# EAGLE design ifcBoard (EAGLE 9.6.2)
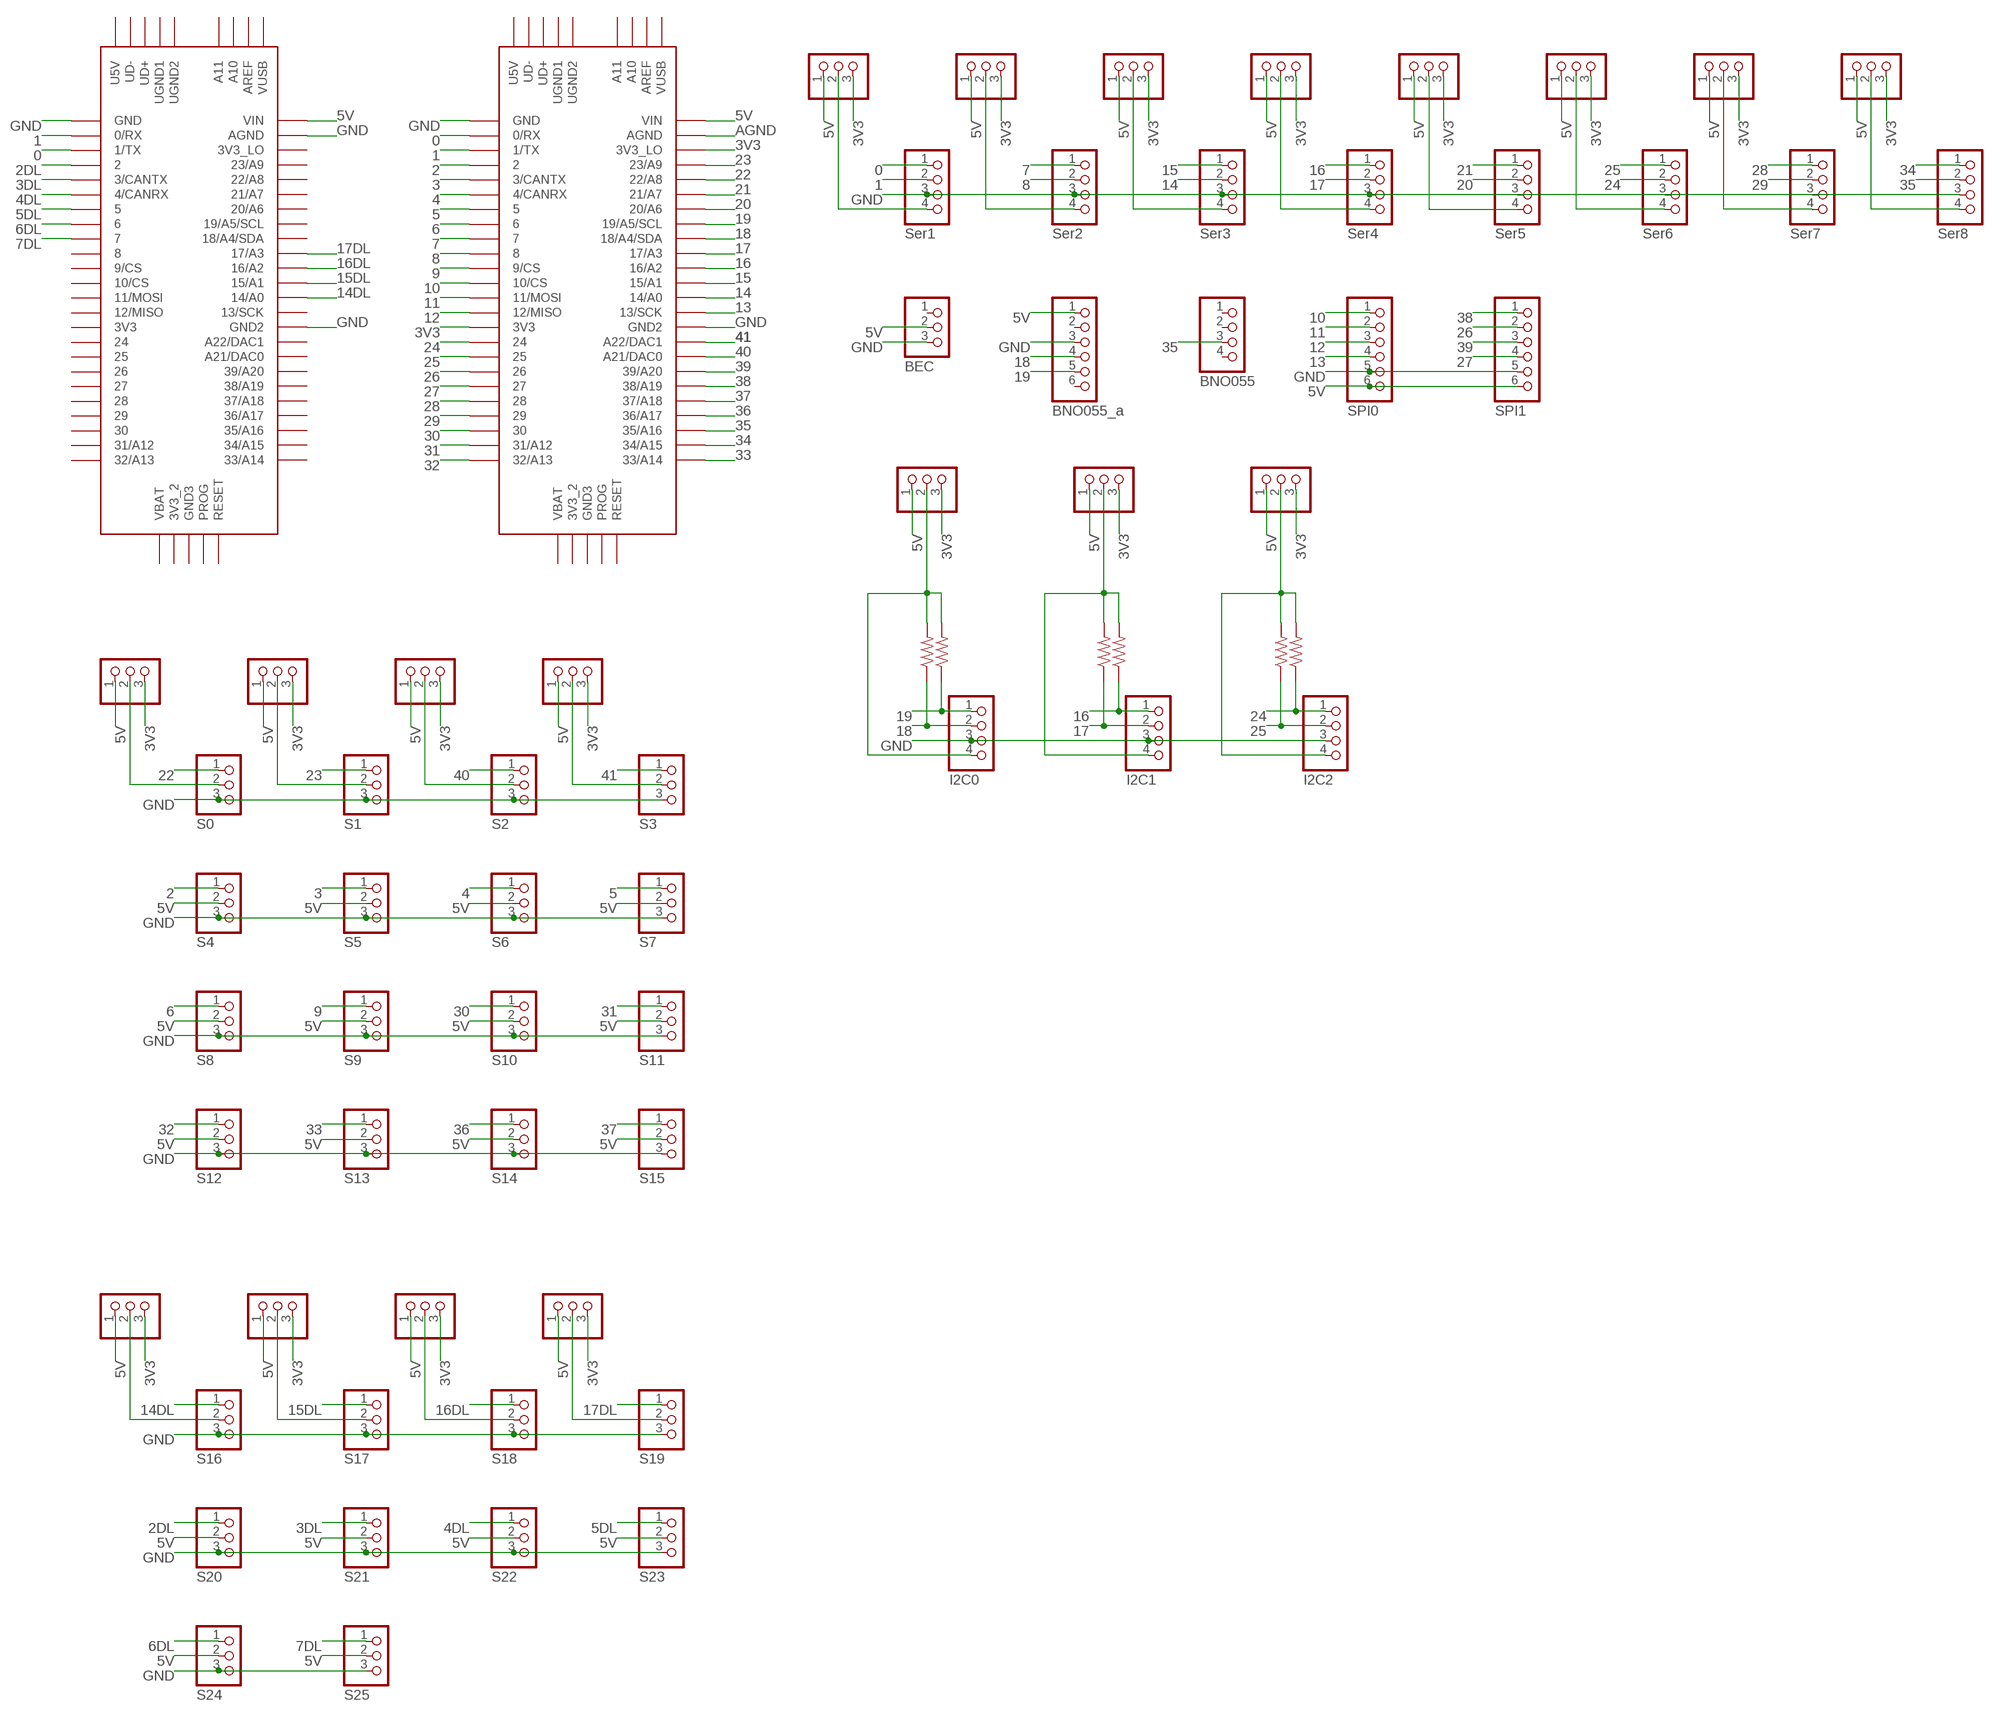
[diagram p0: schematic, sheet 1]

## Parts
JP1  BEC  PINHD-1X3  [1X03]
JP2  S0  PINHD-1X3  [1X03]
JP3  S1  PINHD-1X3  [1X03]
JP4  S2  PINHD-1X3  [1X03]
JP5  S3  PINHD-1X3  [1X03]
JP6  S4  PINHD-1X3  [1X03]
JP7  S5  PINHD-1X3  [1X03]
JP8  S6  PINHD-1X3  [1X03]
JP9  S7  PINHD-1X3  [1X03]
JP10  S8  PINHD-1X3  [1X03]
JP11  S9  PINHD-1X3  [1X03]
JP12  S10  PINHD-1X3  [1X03]
JP13  S11  PINHD-1X3  [1X03]
JP14  S12  PINHD-1X3  [1X03]
JP15  S13  PINHD-1X3  [1X03]
JP16  S14  PINHD-1X3  [1X03]
JP17  S15  PINHD-1X3  [1X03]
JP18  Ser6  PINHD-1X4  [1X04]
JP19  S0  PINHD-1X3  [1X03]
JP20  S0  PINHD-1X3  [1X03]
JP21  Ser7  PINHD-1X4  [1X04]
JP22  I2C0  PINHD-1X4  [1X04]
JP23  Ser1  PINHD-1X4  [1X04]
JP24  Ser2  PINHD-1X4  [1X04]
JP25  Ser3  PINHD-1X4  [1X04]
JP26  Ser4  PINHD-1X4  [1X04]
JP27  Ser5  PINHD-1X4  [1X04]
JP28  I2C1  PINHD-1X4  [1X04]
JP29  I2C2  PINHD-1X4  [1X04]
JP30  Ser8  PINHD-1X4  [1X04]
JP31  SPI0  PINHD-1X6  [1X06]
JP32  SPI1  PINHD-1X6  [1X06]
JP33  BNO055_a  PINHD-1X6  [1X06]
JP34  BNO055  PINHD-1X4  [1X04]
JP35  S0  PINHD-1X3  [1X03]
JP36  S0  PINHD-1X3  [1X03]
JP37  S0  PINHD-1X3  [1X03]
JP38  S0  PINHD-1X3  [1X03]
JP39  S0  PINHD-1X3  [1X03]
JP40  S0  PINHD-1X3  [1X03]
JP41  S0  PINHD-1X3  [1X03]
JP42  S0  PINHD-1X3  [1X03]
JP43  S0  PINHD-1X3  [1X03]
JP44  S0  PINHD-1X3  [1X03]
JP45  S0  PINHD-1X3  [1X03]
JP46  S0  PINHD-1X3  [1X03]
JP47  S0  PINHD-1X3  [1X03]
JP58  S16  PINHD-1X3  [1X03]
JP59  S17  PINHD-1X3  [1X03]
JP60  S18  PINHD-1X3  [1X03]
JP61  S19  PINHD-1X3  [1X03]
JP62  S23  PINHD-1X3  [1X03]
JP63  S22  PINHD-1X3  [1X03]
JP64  S0  PINHD-1X3  [1X03]
JP65  S0  PINHD-1X3  [1X03]
JP66  S0  PINHD-1X3  [1X03]
JP67  S0  PINHD-1X3  [1X03]
JP68  S21  PINHD-1X3  [1X03]
JP69  S20  PINHD-1X3  [1X03]
JP70  S24  PINHD-1X3  [1X03]
JP71  S25  PINHD-1X3  [1X03]
R2  R-US_0207/12  [0207/12]
R3  R-US_0207/12  [0207/12]
R4  R-US_0207/12  [0207/12]
R5  R-US_0207/12  [0207/12]
R6  R-US_0207/12  [0207/12]
R7  R-US_0207/12  [0207/12]
U$1  TEENSY_3.5/3.6  [TEENSY_3.5/3.6]
U$2  TEENSY_3.5/3.6  [TEENSY_3.5/3.6]

## Nets
0: JP23.1 U$1.0/RX U$2.1/TX
1: JP23.2 U$1.1/TX U$2.0/RX
2: JP6.1 U$1.2
2DL: JP69.1 U$2.2
3: JP7.1 U$1.3/CANTX
3DL: JP68.1 U$2.3/CANTX
3V3: JP19.3 JP20.3 JP35.3 JP36.3 JP37.3 JP38.3 JP39.3 JP40.3 JP41.3 JP42.3 JP43.3 JP44.3 JP45.3 JP46.3 JP47.3 JP64.3 JP65.3 JP66.3 JP67.3 U$1.3V3 U$1.3V3_LO
4: JP8.1 U$1.4/CANRX
4DL: JP63.1 U$2.4/CANRX
5: JP9.1 U$1.5
5DL: JP62.1 U$2.5
5V: JP1.2 JP6.2 JP7.2 JP8.2 JP9.2 JP10.2 JP11.2 JP12.2 JP13.2 JP14.2 JP15.2 JP16.2 JP17.2 JP19.1 JP20.1 JP22.4 JP31.6 JP32.6 JP33.1 JP35.1 JP36.1 JP37.1 JP38.1 JP39.1 JP40.1 JP40.2 JP41.1 JP42.1 JP43.1 JP44.1 JP45.1 JP46.1 JP47.1 JP62.2 JP63.2 JP64.1 JP65.1 JP66.1 JP67.1 JP68.2 JP69.2 JP70.2 JP71.2 R2.2 R3.2 U$1.VIN U$2.VIN
6: JP10.1 U$1.6
6DL: JP70.1 U$2.6
7: JP24.1 U$1.7
7DL: JP71.1 U$2.7
8: JP24.2 U$1.8
9: JP11.1 U$1.9/CS
10: JP31.1 U$1.10/CS
11: JP31.2 U$1.11/MOSI
12: JP31.3 U$1.12/MISO
13: JP31.4 U$1.13/SCK
14: JP25.2 U$1.14/A0
14DL: JP58.1 U$2.14/A0
15: JP25.1 U$1.15/A1
15DL: JP59.1 U$2.15/A1
16: JP26.1 JP28.1 R6.1 U$1.16/A2
16DL: JP60.1 U$2.16/A2
17: JP26.2 JP28.2 R4.1 U$1.17/A3
17DL: JP61.1 U$2.17/A3
18: JP22.2 JP33.4 R2.1 U$1.18/A4/SDA
19: JP22.1 JP33.5 R3.1 U$1.19/A5/SCL
20: JP27.2 U$1.20/A6
21: JP27.1 U$1.21/A7
22: JP2.1 U$1.22/A8
23: JP3.1 U$1.23/A9
24: JP18.2 JP29.1 R5.1 U$1.24
25: JP18.1 JP29.2 R7.1 U$1.25
26: JP32.2 U$1.26
27: JP32.4 U$1.27
28: JP21.1 U$1.28
29: JP21.2 U$1.29
30: JP12.1 U$1.30
31: JP13.1 U$1.31/A12
32: JP14.1 U$1.32/A13
33: JP15.1 U$1.33/A14
34: JP30.1 U$1.34/A15
35: JP30.2 JP34.3 U$1.35/A16
36: JP16.1 U$1.36/A17
37: JP17.1 U$1.37/A18
38: JP32.1 U$1.38/A19
39: JP32.3 U$1.39/A20
40: JP4.1 U$1.21/DAC0(A21/DAC0)
41: JP5.1 U$1.A22/DAC1
AGND: U$1.AGND
GND: JP1.3 JP2.3 JP3.3 JP4.3 JP5.3 JP6.3 JP7.3 JP8.3 JP9.3 JP10.3 JP11.3 JP12.3 JP13.3 JP14.3 JP15.3 JP16.3 JP17.3 JP18.3 JP21.3 JP22.3 JP23.3 JP24.3 JP25.3 JP26.3 JP27.3 JP28.3 JP29.3 JP30.3 JP31.5 JP32.5 JP33.3 JP58.3 JP59.3 JP60.3 JP61.3 JP62.3 JP63.3 JP68.3 JP69.3 JP70.3 JP71.3 U$1.GND U$1.GND2 U$2.AGND U$2.GND U$2.GND2
N$1: JP19.2 JP23.4
N$2: JP58.2 JP64.2
N$3: JP59.2 JP65.2
N$4: JP60.2 JP66.2
N$5: JP61.2 JP67.2
N$8: JP20.2 JP24.4
N$15: JP25.4 JP35.2
N$20: JP26.4 JP36.2
N$21: JP2.2 JP42.2
N$22: JP27.4 JP37.2
N$23: JP29.4 JP44.2 R5.2 R7.2
N$24: JP28.4 JP43.2 R4.2 R6.2
N$25: JP18.4 JP38.2
N$26: JP21.4 JP39.2
N$27: JP30.4 JP41.2
N$28: JP3.2 JP45.2
N$29: JP4.2 JP46.2
N$30: JP5.2 JP47.2
Unconnected: JP1.1 JP33.2 JP33.6 JP34.1 JP34.2 JP34.4 U$1.3V3_2 U$1.A10 U$1.A11 U$1.AREF U$1.GND3 U$1.PROG U$1.RESET U$1.U5V U$1.UD+ U$1.UD- U$1.UGND1 U$1.UGND2 U$1.VBAT U$1.VUSB U$2.3V3 U$2.3V3_2 U$2.3V3_LO U$2.8 U$2.9/CS U$2.10/CS U$2.11/MOSI U$2.12/MISO U$2.13/SCK U$2.18/A4/SDA U$2.19/A5/SCL U$2.20/A6 U$2.21/A7 U$2.21/DAC0(A21/DAC0) U$2.22/A8 U$2.23/A9 U$2.24 U$2.25 U$2.26 U$2.27 U$2.28 U$2.29 U$2.30 U$2.31/A12 U$2.32/A13 U$2.33/A14 U$2.34/A15 U$2.35/A16 U$2.36/A17 U$2.37/A18 U$2.38/A19 U$2.39/A20 U$2.A10 U$2.A11 U$2.A22/DAC1 U$2.AREF U$2.GND3 U$2.PROG U$2.RESET U$2.U5V U$2.UD+ U$2.UD- U$2.UGND1 U$2.UGND2 U$2.VBAT U$2.VUSB

## Library data of the parts
JP1-JP17 JP19 JP20 JP35-JP47 JP58-JP71 = adafruit:PINHD-1X3: PIN HEADER
JP18 JP21-JP30 JP34 = pinhead:PINHD-1X4: PIN HEADER
JP31-JP33 = adafruit:PINHD-1X6: PIN HEADER
R2-R7 = rcl:R-US_: RESISTOR, American symbol; SPICEPREFIX: R
U$1 U$2 = Teensy356:TEENSY_3.5/3.6

## Board
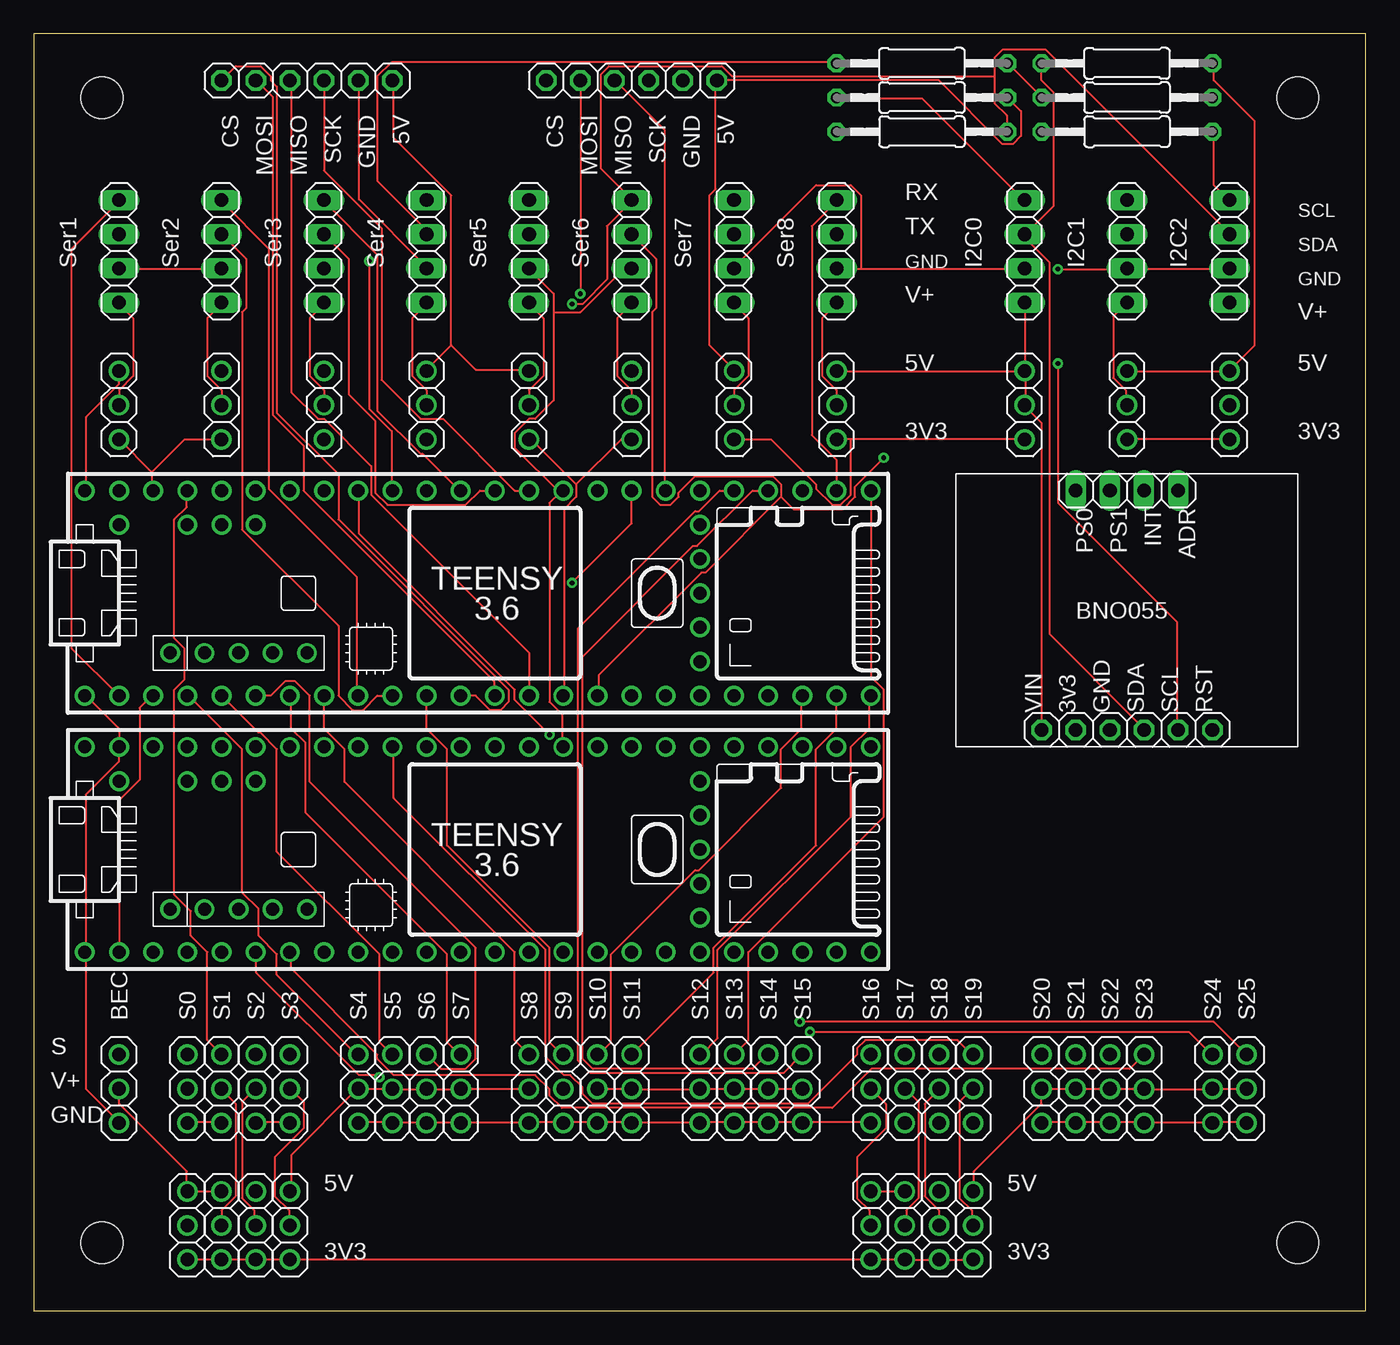
[diagram p1: board, top side]
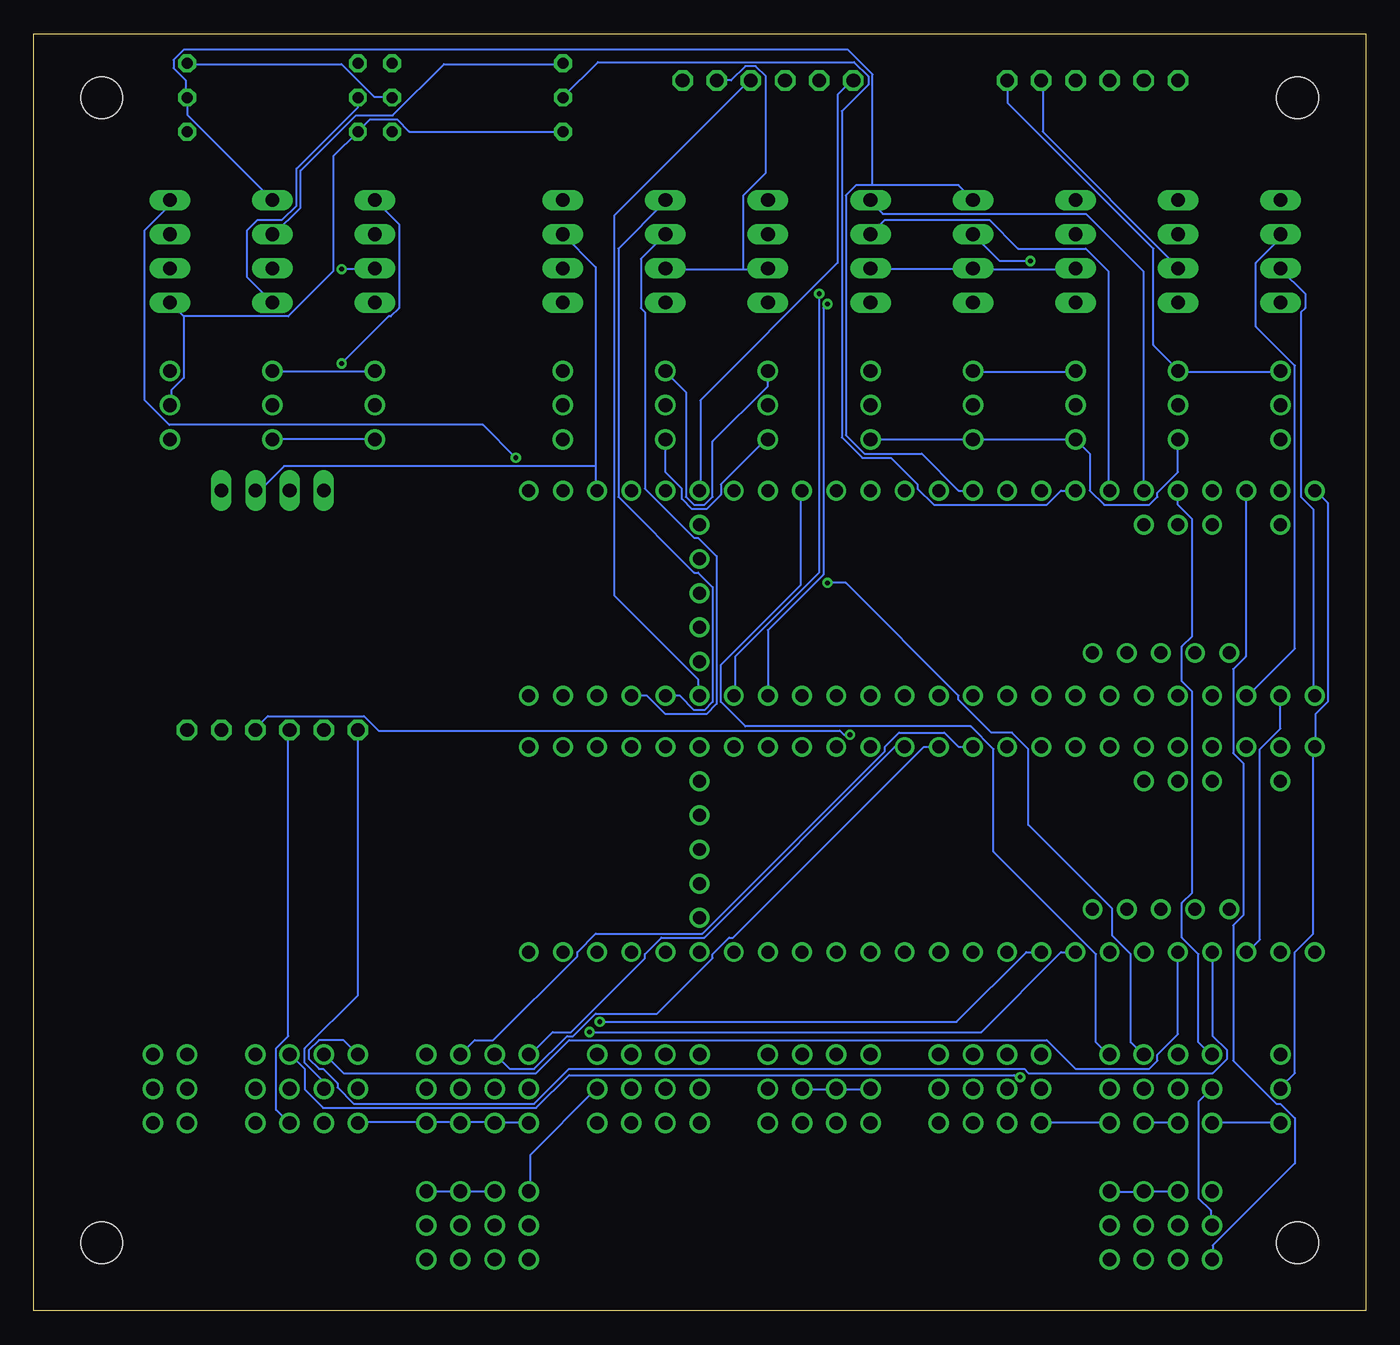
[diagram p2: board, bottom side, seen from below]

Size 99.04 x 94.92 mm. Coordinates in mm from the lower left corner, seen from the top.
Outline: 0,0 99.04,0 99.04,94.92 0,94.92 0,0
Copper layers (1*16): Top 0.035mm / dielectric 1.5mm / Bottom 0.035mm
Design rules "default": minimum track width 6mil, minimum drill 0.35mm, track to track 6mil, track to pad 6mil, pad to pad 6mil, via to via 6mil, smd to smd 6mil, copper to edge 40mil, drill to drill 6mil, minimum pad ring 10mil, minimum via ring 8mil, stop-mask expansion 4mil, vias tented up to drill 0mil, thermal gap 10mil
Holes 3.1 mm at 93.98,90.17 5.08,90.17 5.08,5.08 93.98,5.08

### Footprints (pad centres in the part's own frame; a part is rotated, then mirrored left to right if it is on the bottom)
1X03 = drill 1.016: 1 -2.54,0; 2 0,0; 3 2.54,0
1X04 = drill 1.016 long: 1 -3.81,0; 2 -1.27,0; 3 1.27,0; 4 3.81,0
1X06 = drill 1.016 octagon: 1 -6.35,0; 2 -3.81,0; 3 -1.27,0; 4 1.27,0; 5 3.81,0; 6 6.35,0
0207/12 = drill 0.813 octagon: 1 -6.35,0; 2 6.35,0
TEENSY_3.5/3.6 = drill 0.965: 0/RX -25.4,-7.62; 1/TX -22.86,-7.62; 2 -20.32,-7.62; 3/CANTX -17.78,-7.62; 3V3 7.62,-7.62; 3V3_2 17.78,-2.54; 3V3_LO -22.86,7.62; 4/CANRX -15.24,-7.62; 5 -12.7,-7.62; 6 -10.16,-7.62; 7 -7.62,-7.62; 8 -5.08,-7.62; 9/CS -2.54,-7.62; 10/CS 0,-7.62; 11/MOSI 2.54,-7.62; 12/MISO 5.08,-7.62; 13/SCK 5.08,7.62; 14/A0 2.54,7.62; 15/A1 0,7.62; 16/A2 -2.54,7.62; 17/A3 -5.08,7.62; 18/A4/SDA -7.62,7.62; 19/A5/SCL -10.16,7.62; 20/A6 -12.7,7.62; 21/A7 -15.24,7.62; 21/DAC0 12.7,7.62; 22/A8 -17.78,7.62; 23/A9 -20.32,7.62; 24 10.16,-7.62; 25 12.7,-7.62; 26 15.24,-7.62; 27 17.78,-7.62; 28 20.32,-7.62; 29 22.86,-7.62; 30 25.4,-7.62; 31/A12 27.94,-7.62; 32/A13 30.48,-7.62; 33/A14 30.48,7.62; 34/A15 27.94,7.62; 35/A16 25.4,7.62; 36/A17 22.86,7.62; 37/A18 20.32,7.62; 38/A19 17.78,7.62; 39/A20 15.24,7.62; A10 -17.78,5.08; A11 -15.24,5.08; A22/DAC1 10.16,7.62; AGND -25.4,7.62; AREF -20.32,5.08; GND -27.94,-7.62; GND2 7.62,7.62; GND3 17.78,0; PROG 17.78,2.54; RESET 17.78,5.08; U5V -21.59,-4.445; UD+ -16.51,-4.445; UD- -19.05,-4.445; UGND1 -13.97,-4.445; UGND2 -11.43,-4.445; VBAT 17.78,-5.08; VIN -27.94,7.62; VUSB -25.4,5.08

### Placement (x,y rotation side)
JP1  6.35,16.51 270 top
JP2  11.43,16.51 270 top
JP3  13.97,16.51 270 top
JP4  16.51,16.51 270 top
JP5  19.05,16.51 270 top
JP6  24.13,16.51 270 top
JP7  26.67,16.51 270 top
JP8  29.21,16.51 270 top
JP9  31.75,16.51 270 top
JP10  36.83,16.51 270 top
JP11  39.37,16.51 270 top
JP12  41.91,16.51 270 top
JP13  44.45,16.51 270 top
JP14  49.53,16.51 270 top
JP15  52.07,16.51 270 top
JP16  54.61,16.51 270 top
JP17  57.15,16.51 270 top
JP18  44.45,78.74 270 top
JP19  6.35,67.31 270 top
JP20  13.97,67.31 270 top
JP21  52.07,78.74 270 top
JP22  73.66,78.74 270 top
JP23  6.35,78.74 270 top
JP24  13.97,78.74 270 top
JP25  21.59,78.74 270 top
JP26  29.21,78.74 270 top
JP27  36.83,78.74 270 top
JP28  81.28,78.74 270 top
JP29  88.9,78.74 270 top
JP30  59.69,78.74 270 top
JP31  20.32,91.44 0 top
JP32  44.45,91.44 0 top
JP33  81.28,43.18 0 top
JP34  81.28,60.96 0 top
JP35  21.59,67.31 270 top
JP36  29.21,67.31 270 top
JP37  36.83,67.31 270 top
JP38  44.45,67.31 270 top
JP39  52.07,67.31 270 top
JP40  73.66,67.31 270 top
JP41  59.69,67.31 270 top
JP42  11.43,6.35 270 top
JP43  81.28,67.31 270 top
JP44  88.9,67.31 270 top
JP45  13.97,6.35 270 top
JP46  16.51,6.35 270 top
JP47  19.05,6.35 270 top
JP58  62.23,16.51 270 top
JP59  64.77,16.51 270 top
JP60  67.31,16.51 270 top
JP61  69.85,16.51 270 top
JP62  82.55,16.51 270 top
JP63  80.01,16.51 270 top
JP64  62.23,6.35 270 top
JP65  64.77,6.35 270 top
JP66  67.31,6.35 270 top
JP67  69.85,6.35 270 top
JP68  77.47,16.51 270 top
JP69  74.93,16.51 270 top
JP70  87.63,16.51 270 top
JP71  90.17,16.51 270 top
R2  81.28,92.71 0 top
R3  66.04,90.17 0 top
R4  66.04,92.71 0 top
R5  81.28,87.63 180 top
R6  81.28,90.17 180 top
R7  66.04,87.63 180 top
U$1  31.75,53.34 0 top
U$2  31.75,34.29 0 top

### Tracks (layer width: path | path; a pad name or v marks a point on that pad's centre or on a via)
0
  Top 0.152: U$1.0/RX 2.85,49.23 2.85,78.94 6.35,82.45 JP23.1
  Bottom 0.152: U$1.0/RX 6.35,43.28 7.87,41.76 7.87,27.58 8.79,26.67 U$2.1/TX
1
  Top 0.152: U$2.0/RX 6.35,37.95 7.87,39.47 7.87,44.81 8.79,45.72 U$1.1/TX
  Bottom 0.152: JP23.2 6.35,79.7 8.18,77.88 8.18,73.15 5.28,70.26 5.28,49.23 8.79,45.72 U$1.1/TX
2
  Top 0.152: U$1.2 11.53,45.72 15.49,41.76 15.49,31.09 16.71,29.87 16.71,27.89 18.09,26.52 18.09,24.99 24.03,19.05 JP6.1
2DL
  Bottom 0.152: JP69.1 76,20.12 77.83,20.12 78.59,19.36 78.59,18.75 77.83,17.98 77.52,17.98 76.45,16.92 76.45,16.61 75.23,15.39 61.82,15.39 59.23,17.98 25.4,17.98 25.09,17.68 11.38,17.68 10.31,18.75 10.31,19.36 11.38,20.42 11.38,26.67 U$2.2
3
  Top 0.152: U$1.3/CANTX 16.71,42.98 16.87,42.98 18.09,41.76 18.09,34.14 25.7,26.52 25.7,19.96 26.62,19.05 JP7.1
3DL
  Bottom 0.152: U$2.3/CANTX 13.97,20.57 15.49,19.05 15.49,18.59 16.1,17.98 21.59,17.98 23.72,20.12 59.23,20.12 61.67,17.68 76,17.68 77.37,19.05 JP68.1
3V3
  Top 0.152: JP42.3 JP45.3 JP46.3 JP47.3 JP64.3 JP65.3 JP66.3 JP67.3 | JP44.3 JP43.3 | JP40.3 60.76,64.77 | 60.76,64.77 JP41.3 | 8.79,62.33 8.79,60.96 U$1.3V3_LO | JP19.3 8.79,62.33 | JP20.3 11.23,64.77 8.79,62.33 | 40.34,61.42 40.34,60.5 39.42,59.59 39.42,45.72 U$1.3V3 | 40.34,61.42 36.98,64.77 JP37.3 | JP38.3 43.69,64.77 40.34,61.42 | 60.76,64.77 60.76,60.66 59.99,59.89 59.38,59.89 58.17,61.11 58.17,61.42 54.81,64.77 JP39.3
  Bottom 0.152: JP40.3 JP43.3 | JP39.3 52.07,62.33 50.85,61.11 50.85,60.35 50.09,59.59 49.02,59.59 47.95,60.66 47.95,61.42 44.6,64.77 JP38.3 | JP37.3 JP36.3 JP35.3 20.52,63.7 20.52,60.96 19.46,59.89 16.1,59.89 15.49,60.5 15.49,60.81 13.97,62.33 JP20.3 | JP42.3 11.38,3.81 11.38,4.88 5.28,10.97 5.28,14.33 6.35,15.39 6.66,15.39 9.86,18.59 9.86,28.65 9.09,29.41 9.09,40.69 9.86,41.45 9.86,47.7 8.94,48.62 8.94,60.96 U$1.3V3_LO
4
  Top 0.152: U$1.4/CANRX 17.63,45.72 18.69,46.79 19.46,46.79 20.52,45.72 20.52,39.32 32.87,26.97 32.87,18.75 32.11,17.98 30.28,17.98 JP8.1
4DL  (via drill 0.35)
  Top 0.152: v25.7,17.37 25.55,17.53 24.18,17.53 16.56,25.15 16.56,26.67 U$2.4/CANRX
  Bottom 0.152: v25.7,17.37 26.01,17.37 26.16,17.53 59.23,17.53 61.67,15.09 77.52,15.09 78.89,16.46 78.89,17.98 79.96,19.05 JP63.1
5
  Top 0.152: U$1.5 19.15,45.72 19.15,43.28 20.22,42.22 20.22,37.03 30.73,26.52 30.73,19.96 31.65,19.05 JP9.1
5DL
  Top 0.152: JP62.1 81.48,17.98 62.28,17.98 59.38,15.09 39.27,15.09 38.35,16 38.35,16.46 37.29,17.53 26.77,17.53 25.55,18.75 25.55,19.05 19.15,25.45 19.15,26.67 U$2.5
5V
  Top 0.152: JP39.1 52.07,69.95 50.24,71.78 50.24,82.91 50.7,83.36 50.7,91.44 JP32.6 67.31,91.44 72.03,86.72 72.8,86.72 73.41,87.33 73.41,89.15 R3.2 | JP43.1 81.33,69.8 88.8,69.8 JP44.1 88.95,69.95 90.78,71.78 90.78,88.39 87.73,91.44 87.73,92.66 R2.2 | JP40.1 73.71,69.8 73.71,67.36 JP40.2 73.71,67.21 74.93,65.99 JP33.1 | JP41.1 59.69,69.8 73.56,69.8 JP40.1 | JP22.4 73.71,74.83 73.71,69.95 JP40.1 | 31.04,71.78 31.04,82.91 26.77,87.17 26.77,91.44 JP31.6 | 31.04,71.78 29.21,69.95 JP36.1 | 31.04,71.78 32.87,69.95 36.83,69.95 JP37.1 | JP19.1 6.35,68.89 3.91,66.45 3.91,60.96 U$1.VIN | JP45.1 13.97,8.84 11.53,8.84 JP42.1 11.38,8.99 11.38,10.36 6.35,15.39 JP1.2 | JP71.2 90.17,16.46 87.73,16.46 JP70.2 87.58,16.46 82.55,16.46 | 74.93,16.46 77.37,16.46 JP68.2 77.52,16.46 79.96,16.46 JP63.2 80.11,16.46 82.55,16.46 | 82.55,16.46 JP62.2 | JP64.1 62.28,8.84 64.72,8.84 JP65.1 | 52.07,16.46 49.63,16.46 JP14.2 49.48,16.46 44.45,16.46 | JP17.2 57.1,16.46 54.66,16.46 JP16.2 54.51,16.46 52.07,16.46 | 52.07,16.46 JP15.2 | 29.21,16.46 26.77,16.46 JP7.2 26.62,16.46 24.18,16.46 JP6.2 24.03,16.46 19.15,11.58 19.15,8.99 JP47.1 | 29.21,16.46 31.65,16.46 JP9.2 31.8,16.46 36.83,16.46 JP10.2 | 29.21,16.46 JP8.2 | 44.45,16.46 42.01,16.46 JP12.2 | 44.45,16.46 JP13.2 | 74.93,16.46 74.93,15.39 69.9,10.36 69.9,8.99 JP67.1 | 74.93,16.46 JP69.2
  Bottom 0.152: JP38.1 44.45,68.73 48.56,64.62 48.56,60.5 49.17,59.89 49.94,59.89 50.55,60.5 50.55,68.28 52.07,69.8 JP39.1 | R3.2 72.49,90.22 73.71,90.22 76.15,92.66 87.58,92.66 R2.2 | JP43.1 81.18,69.8 73.71,69.8 JP40.1 | JP35.1 21.59,69.8 29.21,69.8 JP36.1 | JP19.1 6.35,69.8 13.97,69.8 JP20.1 13.97,69.95 15.8,71.78 15.8,78.94 26.62,89.76 26.62,91.44 JP31.6 | U$1.VIN 3.76,60.96 2.85,60.05 2.85,45.26 3.76,44.35 3.76,41.91 U$2.VIN 3.91,41.91 3.91,28.04 5.28,26.67 5.28,17.68 6.35,16.61 JP1.2 | JP47.1 19,8.84 16.56,8.84 JP46.1 16.41,8.84 13.97,8.84 JP45.1 | 67.31,8.84 64.87,8.84 JP65.1 | 67.31,8.84 69.75,8.84 JP67.1 | 67.31,8.84 JP66.1 | JP10.2 36.83,16.46 39.27,16.46 JP11.2 39.42,16.46 41.86,16.46 JP12.2 | JP64.1 62.13,8.99 62.13,11.58 57.25,16.46 JP17.2 | JP33.1 74.93,23.47 78.89,19.51 78.89,18.44 77.52,17.07 77.52,16.61 JP68.2
6
  Top 0.152: U$1.6 21.59,43.28 23.11,41.76 23.11,39.32 35.76,26.67 35.76,20.12 JP10.1
6DL  (via drill 0.35)
  Top 0.152: v57.71,20.73 85.9,20.73 87.58,19.05 JP70.1
  Bottom 0.152: U$2.6 22.66,26.67 28.6,20.73 v57.71,20.73
7
  Top 0.152: U$1.7 24.03,45.72 24.03,54.56 17.48,61.11 17.48,78.94 13.97,82.45 JP24.1
7DL  (via drill 0.35)
  Top 0.152: v56.95,21.49 87.73,21.49 JP71.1
  Bottom 0.152: U$2.7 25.25,26.67 30.43,21.49 v56.95,21.49
8
  Top 0.152: U$1.8 25.55,45.72 24.49,44.65 23.72,44.65 22.66,45.72 22.66,50.9 15.49,58.06 15.49,74.22 15.8,74.52 15.8,78.18 JP24.2
9
  Top 0.152: U$1.9/CS 29.21,43.28 30.73,41.76 30.73,34.59 38.35,26.97 38.35,19.96 39.27,19.05 JP11.1
10
  Top 0.152: U$1.10/CS 32.87,45.72 33.93,44.65 34.7,44.65 35.31,45.26 35.31,46.18 22.66,58.83 22.66,62.18 18.09,66.75 18.09,90.98 17.63,91.44 17.63,91.75 16.87,92.51 15.04,92.51 JP31.1
11
  Top 0.152: U$1.11/MOSI 34.24,45.72 34.24,46.79 20.07,60.96 20.07,64.31 17.78,66.6 17.78,90.22 16.56,91.44 JP31.2
12
  Top 0.152: U$1.12/MISO 36.83,48.92 25.09,60.66 25.09,62.79 21.59,66.29 21.13,66.29 19.15,68.28 19.15,91.44 JP31.3
13
  Top 0.152: U$1.13/SCK 35.76,60.96 30.43,66.29 28.75,66.29 25.86,69.19 25.86,80.47 21.59,84.73 JP31.4
14
  Top 0.152: U$1.14/A0 33.17,60.96 32.11,59.89 26.31,59.89 25.4,60.81 25.4,66.14 23.42,68.12 23.42,78.18 JP25.2
14DL
  Bottom 0.152: U$2.14/A0 35,41.91 49.17,27.74 52.38,27.74 53.59,26.52 53.59,26.21 59.08,20.73 60.45,20.73 62.13,19.05 JP58.1
15
  Top 0.152: U$1.15/A1 31.65,60.96 28.9,63.7 28.75,63.7 25.55,66.9 25.55,78.49 21.59,82.45 JP25.1
15DL
  Bottom 0.152: U$2.15/A1 32.87,41.91 47.04,27.74 47.35,27.74 48.56,26.52 48.56,26.21 52.68,22.1 57.25,22.1 58.93,20.42 59.38,20.42 61.82,17.98 63.65,17.98 64.72,19.05 JP59.1
16
  Bottom 0.152: JP28.1 87.58,88.85 87.58,90.07 R6.1 87.73,90.22 87.73,91.44 88.65,92.35 88.65,92.96 87.88,93.73 38.51,93.73 36.68,91.9 36.68,83.67 | U$1.16/A2 30.28,60.96 33.02,63.7 37.29,63.7 38.66,65.08 38.66,82.91 37.9,83.67 36.68,83.67 | 36.68,83.67 30.28,83.67 29.21,82.6 JP26.1
16DL
  Bottom 0.152: U$2.16/A2 30.28,41.91 31.34,42.98 34.7,42.98 35.76,41.91 35.76,41.61 49.33,28.04 57.25,28.04 58.62,26.67 58.62,26.36 64.87,20.12 66.24,20.12 JP60.1
17  (via drill 0.35)
  Top 0.152: v24.94,78.03 24.94,67.06 26.62,65.38 26.62,60.96 U$1.17/A3 | JP26.2 29.21,80.31 25.55,83.97 25.55,91.75 26.62,92.81 59.69,92.81 R4.1
  Bottom 0.152: v24.94,78.03 27.23,78.03 JP26.2 | R4.1 59.69,92.66 68.53,92.66 72.34,88.85 75.08,88.85 79.2,84.73 79.2,81.99 81.18,80.01 JP28.2
17DL
  Top 0.152: U$2.17/A3 26.77,41.91 26.77,38.1 38.05,26.82 38.05,18.9 39.42,17.53 39.88,17.53 40.79,16.61 40.79,16.15 41.55,15.39 57.56,15.39 61.21,19.05 61.21,19.51 61.82,20.12 68.68,20.12 69.75,19.05 JP61.1
18  (via drill 0.35)
  Top 0.152: R2.1 74.93,91.44 75.84,90.53 75.84,82.14 73.71,80.01 | v38.35,42.82 35.76,45.41 35.76,46.18 24.18,57.76 24.18,60.96 U$1.18/A4/SDA | 73.71,80.01 73.71,79.7 75.54,77.88 75.54,50.29 82.55,43.28 JP33.4 | 73.71,80.01 JP22.2
  Bottom 0.152: v38.35,42.82 38.81,42.82 39.12,43.13 73.41,43.13 74.47,44.2 81.64,44.2 82.55,43.28 JP33.4
19  (via drill 0.35)
  Top 0.152: R3.1 59.69,90.07 66.09,90.07 73.56,82.6 JP22.1 | v76.15,70.41 76.15,60.05 84.99,51.21 84.99,43.28 JP33.5
  Bottom 0.152: U$1.19/A5/SCL 22.66,60.96 23.72,59.89 32.11,59.89 33.33,61.11 33.33,61.42 35.31,63.4 37.44,63.4 38.96,64.92 38.96,89.15 36.98,91.14 36.98,91.75 38.05,92.81 57.1,92.81 59.69,90.22 R3.1 | v76.15,70.41 72.64,73.91 72.49,73.91 71.88,74.52 71.88,80.77 JP22.1
20
  Bottom 0.152: JP27.2 35.76,81.08 27.99,81.08 25.86,78.94 20.83,78.94 19.15,77.27 19.15,60.96 U$1.20/A6
21
  Bottom 0.152: U$1.21/A7 16.56,60.96 16.56,77.27 20.83,81.53 35.92,81.53 36.83,82.45 JP27.1
22
  Bottom 0.152: U$1.22/A8 13.97,59.89 12.9,58.83 12.9,50.14 13.66,49.38 13.66,46.79 12.9,46.03 12.9,31.09 13.66,30.33 13.66,27.74 12.45,26.52 12.45,19.96 11.53,19.05 JP2.1
23
  Top 0.152: JP3.1 12.9,20.12 12.9,26.67 11.68,27.89 11.68,29.72 10.46,30.94 10.46,46.18 11.23,46.94 11.23,49.23 10.46,49.99 10.46,58.83 11.38,59.74 11.38,60.96 U$1.23/A9
24  (via drill 0.35)
  Top 0.152: R5.1 87.73,87.63 87.73,83.67 88.8,82.6 JP29.1 | 55.57,60.5 49.94,54.86 49.63,54.86 42.01,47.24 42.01,45.72 U$1.24 | 55.57,60.5 55.57,61.42 54.97,62.03 49.17,62.03 47.95,60.81 47.95,60.5 47.35,59.89 46.58,59.89 45.97,60.5 45.97,74.22 46.28,74.52 46.28,78.18 JP18.2 | v63.2,63.4 61.06,61.27 61.06,60.5 60.15,59.59 56.49,59.59 55.57,60.5
  Bottom 0.152: v63.2,63.4 65.63,65.84 88.95,65.84 90.78,67.67 90.78,80.31 88.95,82.14 88.95,82.45 JP29.1
25  (via drill 0.35)
  Top 0.152: 71.43,91.75 71.43,93.12 72.03,93.73 75.23,93.73 88.95,80.01 JP29.2 | 71.43,91.75 71.43,89.76 72.34,88.85 72.34,87.63 R7.1 | v40.03,74.83 40.79,74.83 42.62,76.66 42.62,80.62 44.45,82.45 JP18.1 44.45,82.6 42.16,84.89 42.16,91.9 42.77,92.51 51.16,92.51 51.92,91.75 71.43,91.75
  Bottom 0.152: U$1.25 44.45,50.6 40.34,54.71 40.34,74.52 v40.03,74.83
26  (via drill 0.35)
  Top 0.152: JP32.2 v40.64,75.59
  Bottom 0.152: v40.64,75.59 40.64,54.86 46.89,48.62 46.89,45.72 U$1.26
27
  Bottom 0.152: U$1.27 49.63,45.72 49.63,46.94 55.88,53.19 55.88,81.38 45.82,91.44 JP32.4
28
  Bottom 0.152: U$1.28 51,45.72 49.94,44.65 49.17,44.65 48.56,45.26 48.56,53.8 49.63,54.86 49.94,54.86 55.57,60.5 55.57,78.94 52.07,82.45 JP21.1
29
  Bottom 0.152: U$1.29 53.44,45.72 52.07,44.35 49.02,44.35 48.26,45.11 48.26,56.08 49.63,57.46 49.94,57.46 53.59,61.11 53.59,74.22 53.9,74.52 53.9,78.18 JP21.2
30
  Top 0.152: U$1.30 57.1,45.72 57.1,43.28 55.57,41.76 55.57,38.86 49.48,32.77 49.17,32.77 42.93,26.52 42.93,19.96 42.01,19.05 JP12.1
31
  Top 0.152: U$1.31/A12 59.69,43.28 58.17,41.76 58.17,34.59 50.55,26.97 50.55,25.15 JP13.1
32
  Top 0.152: U$1.32/A13 62.13,45.72 62.13,43.28 60.76,41.91 60.76,36.73 50.85,26.82 50.85,20.27 49.63,19.05 JP14.1
33
  Top 0.152: JP15.1 53.14,20.12 53.14,26.67 63.2,36.73 63.2,46.18 62.28,47.09 62.28,60.96 U$1.33/A14
34
  Top 0.152: U$1.34/A15 59.69,63.25 57.86,65.08 57.86,80.62 59.69,82.45 JP30.1
35
  Bottom 0.152: 57.25,62.79 57.25,77.57 JP30.2 | 57.25,62.79 57.25,60.96 U$1.35/A16 | JP34.3 82.25,60.96 80.42,62.79 57.25,62.79
36
  Top 0.152: U$1.36/A17 53.44,60.96 49.33,56.84 49.02,56.84 40.79,48.62 40.79,18.75 41.55,17.98 53.44,17.98 54.51,19.05 JP16.1
37
  Top 0.152: U$1.37/A18 51,60.96 49.48,59.44 49.17,59.44 40.49,50.75 40.49,18.59 41.4,17.68 55.73,17.68 57.1,19.05 JP17.1
38
  Bottom 0.152: U$1.38/A19 49.48,60.96 49.48,67.67 39.27,77.88 39.27,90.37 38.2,91.44 JP32.1
39
  Top 0.152: U$1.39/A20 46.89,60.96 46.89,87.78 43.23,91.44 JP32.3
40  (via drill 0.35)
  Top 0.152: U$1.21/DAC0 44.45,58.52 v40.03,54.1
  Bottom 0.152: v40.03,54.1 38.66,54.1 30.28,45.72 30.28,45.41 27.84,42.98 26.31,42.98 25.09,41.76 25.09,36.12 18.85,29.87 18.85,27.89 17.48,26.52 17.48,19.96 16.56,19.05 JP4.1
41
  Bottom 0.152: U$1.A22/DAC1 42.01,60.96 42.01,53.95 47.95,48.01 47.95,45.26 46.13,43.43 29.36,43.43 27.69,41.76 27.69,34.14 20.07,26.52 20.07,19.96 19.15,19.05 JP5.1
GND  (via drill 0.35)
  Top 0.152: JP71.3 90.17,14.02 87.73,14.02 JP70.3 87.58,14.02 82.55,14.02 | JP69.3 74.93,14.02 77.37,14.02 JP68.3 77.52,14.02 79.96,14.02 JP63.3 80.11,14.02 82.55,14.02 | 82.55,14.02 JP62.3 | U$1.GND 3.91,45.72 6.35,43.28 U$2.AGND 6.35,40.84 3.91,38.41 3.91,26.67 | 3.91,26.67 3.91,16.46 6.35,14.02 JP1.3 | 3.91,26.67 U$2.GND | 52.07,14.02 49.63,14.02 JP14.3 49.48,14.02 44.45,14.02 | 52.07,14.02 54.51,14.02 JP16.3 54.66,14.02 57.1,14.02 JP17.3 57.25,14.02 62.13,14.02 JP58.3 | 52.07,14.02 JP15.3 | 36.83,14.02 39.27,14.02 JP11.3 39.42,14.02 41.86,14.02 JP12.3 42.01,14.02 44.45,14.02 | JP2.3 11.53,14.02 13.97,14.02 JP3.3 | JP4.3 16.56,14.02 19,14.02 JP5.3 | JP6.3 24.18,14.02 26.62,14.02 JP7.3 26.77,14.02 29.21,14.02 | 29.21,14.02 31.65,14.02 JP9.3 31.8,14.02 36.83,14.02 | 29.21,14.02 JP8.3 | 36.83,14.02 JP10.3 | 44.45,14.02 JP13.3 | JP29.3 88.8,77.42 81.33,77.42 JP28.3 81.18,77.42 v76.15,77.42 | 61.52,77.42 73.56,77.42 JP22.3 | 61.52,77.42 59.69,77.42 JP30.3 | 39.12,60.81 39.27,60.96 U$1.GND2 39.12,60.81 | 39.12,60.81 38.35,60.05 38.35,45.26 39.27,44.35 39.27,41.91 U$2.GND2 | JP23.3 6.35,77.42 13.97,77.42 JP24.3 | JP31.5 24.18,91.44 24.18,82.6 29.21,77.57 JP26.3 | 39.12,60.81 35.76,64.16 35.76,65.23 36.83,66.29 37.29,66.29 38.66,67.67 38.66,74.22 | 38.66,74.22 38.66,75.59 36.83,77.42 JP27.3 | 38.66,74.22 40.64,74.22 43.84,77.42 44.45,77.42 JP18.3 | 61.52,77.42 61.52,82.91 60.76,83.67 58.17,83.67 52.07,77.57 JP21.3
  Bottom 0.152: JP33.3 80.11,43.13 80.11,20.42 81.03,19.51 81.03,14.94 80.11,14.02 JP63.3 | JP58.3 62.28,14.02 64.72,14.02 JP59.3 64.87,14.02 67.31,14.02 | 67.31,14.02 69.75,14.02 JP61.3 69.9,14.02 74.93,14.02 JP69.3 | 67.31,14.02 JP60.3 | JP3.3 13.97,14.02 16.41,14.02 JP4.3 | JP5.3 19.15,14.02 24.03,14.02 JP6.3 | JP1.3 6.35,14.02 11.38,14.02 JP2.3 | v76.15,77.42 73.71,77.42 JP22.3 | 46.28,77.42 52.07,77.42 JP21.3 | 46.28,77.42 44.45,77.42 JP18.3 | JP32.5 47.19,91.44 46.13,92.51 45.36,92.51 44.6,91.75 44.6,84.58 46.28,82.91 46.28,77.42 | 29.21,77.42 21.59,77.42 JP25.3 | 29.21,77.42 36.83,77.42 JP27.3 | 29.21,77.42 JP26.3 | JP24.3 13.97,77.57 24.03,87.63 24.03,91.44 JP31.5 | U$1.GND 3.91,45.72 3.91,59.59 4.83,60.5 4.83,74.22 4.52,74.52 4.52,75.59 6.35,77.42 JP23.3
N$1
  Top 0.152: JP19.2 6.35,68.43 7.42,69.49 7.42,73.76 6.35,74.83 JP23.4
N$2
  Top 0.152: JP58.2 63.35,15.39 63.35,13.56 61.21,11.43 61.21,8.38 62.13,7.47 62.13,6.4 JP64.2
N$3
  Top 0.152: JP65.2 64.87,6.4 64.87,7.47 65.79,8.38 65.79,15.54 64.87,16.46 JP59.2
N$4
  Top 0.152: JP66.2 67.31,7.47 66.24,8.53 66.24,15.39 67.31,16.46 JP60.2
N$5
  Top 0.152: JP67.2 69.75,6.4 69.75,7.47 68.83,8.38 68.83,15.54 69.75,16.46 JP61.2
N$8
  Top 0.152: JP20.2 13.97,68.43 12.9,69.49 12.9,73.76 13.97,74.83 JP24.4
N$15
  Top 0.152: JP35.2 21.59,68.43 20.52,69.49 20.52,73.76 21.59,74.83 JP25.4
N$20
  Top 0.152: JP36.2 29.21,68.43 28.14,69.49 28.14,73.76 29.21,74.83 JP26.4
N$21
  Bottom 0.152: JP42.2 11.53,6.4 11.53,7.47 12.45,8.38 12.45,15.54 11.53,16.46 JP2.2
N$22
  Top 0.152: JP37.2 36.83,68.43 37.9,69.49 37.9,73.76 36.83,74.83 JP27.4
N$23
  Bottom 0.152: 87.88,73.91 87.88,69.34 88.8,68.43 88.8,67.36 JP44.2 | JP29.4 87.88,73.91 | R7.2 71.12,87.63 72.03,88.54 74.02,88.54 R5.2 76.76,85.8 76.76,77.27 80.11,73.91 87.88,73.91
N$24
  Top 0.152: R4.2 72.49,92.66 74.93,90.22 R6.2 | JP28.4 80.26,73.91 80.26,69.34 81.18,68.43 81.18,67.36 JP43.2
  Bottom 0.152: R6.2 74.93,89.46 79.5,84.89 79.5,82.14 80.57,81.08 82.4,81.08 83.16,80.31 83.16,76.81 JP28.4
N$25
  Top 0.152: JP38.2 44.45,68.43 43.38,69.49 43.38,73.76 44.45,74.83 JP18.4
N$26
  Top 0.152: JP39.2 52.07,68.43 53.14,69.49 53.14,73.76 52.07,74.83 JP21.4
N$27
  Top 0.152: JP41.2 59.69,68.43 58.62,69.49 58.62,73.76 59.69,74.83 JP30.4
N$28
  Top 0.152: JP45.2 13.97,7.47 15.04,8.53 15.04,15.39 13.97,16.46 JP3.2
N$29
  Top 0.152: JP46.2 16.41,6.4 16.41,7.47 15.49,8.38 15.49,15.54 16.41,16.46 JP4.2
N$30
  Top 0.152: JP47.2 19,6.4 19,7.47 17.93,8.53 17.93,11.43 20.07,13.56 20.07,15.54 19.15,16.46 JP5.2

### Text on the board
tNames: CS | MOSI | MISO | SCK | GND | 5V | CS | MOSI | MISO | SCK | GND | 5V | RX | SCL | TX | SDA | GND | GND | V+ | V+ | 5V | 5V | 3V3 | 3V3 | PS0 | PS1 | INT | ADR | VIN | 3v3 | GND | SDA | SCL | RST | S | V+ | GND | 5V | 5V | 3V3 | 3V3